# Altium schematic sheet motion.SchDoc
size A4
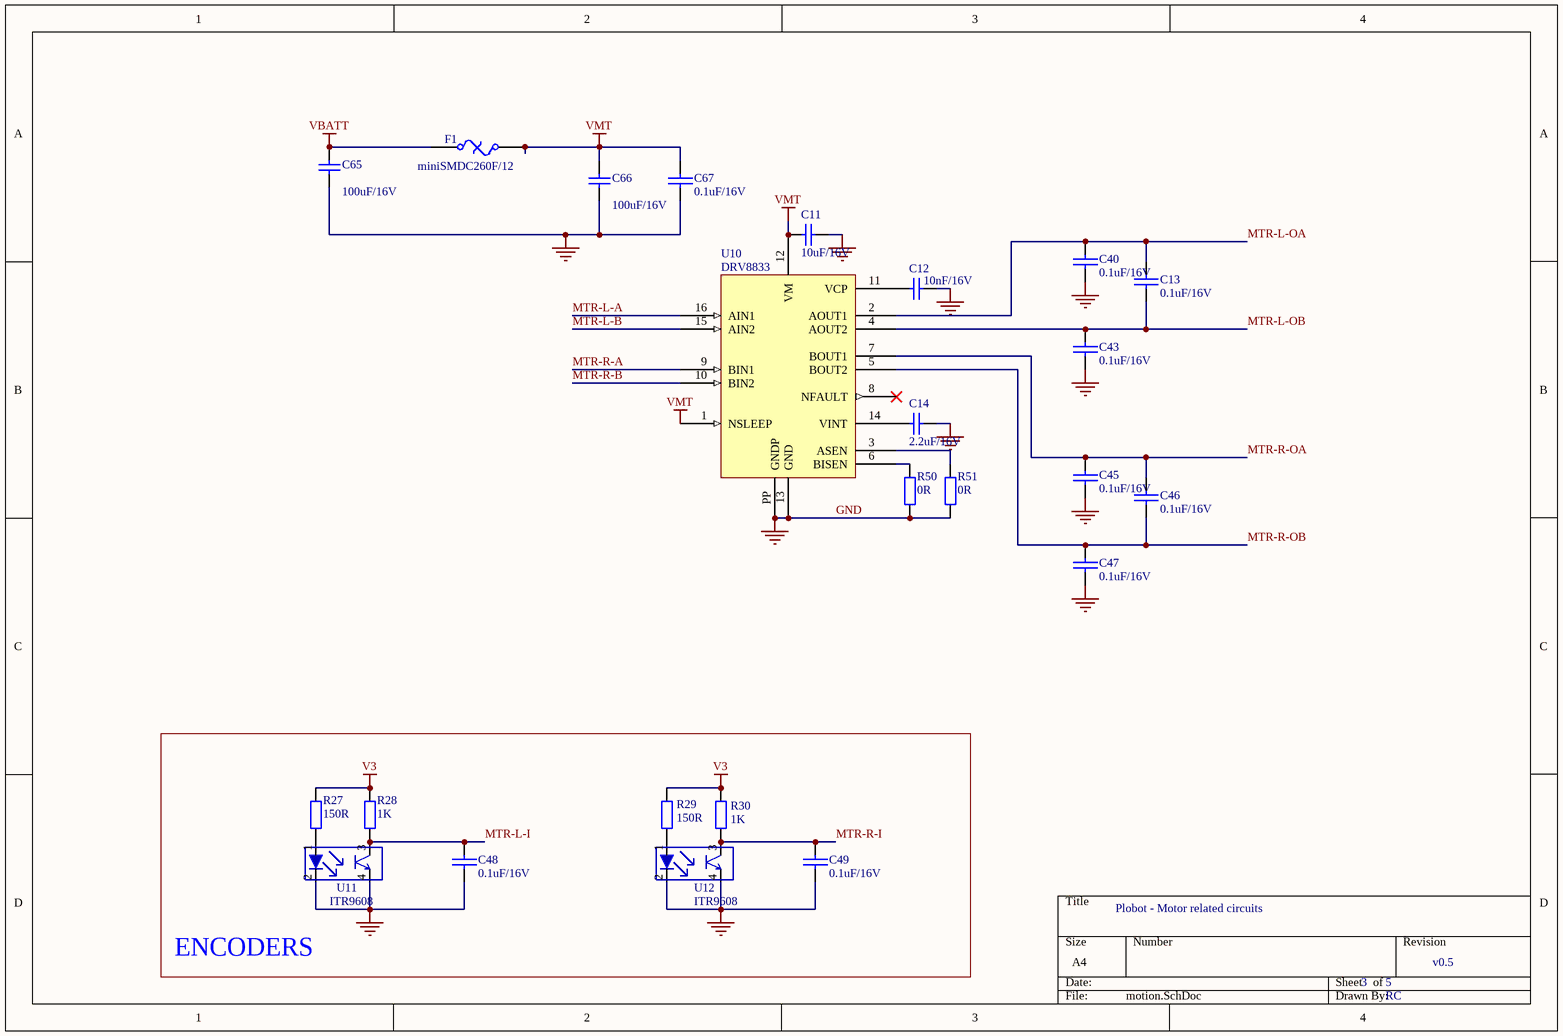
[diagram p0: motion.SchDoc]

## Parts
C11  10uF/16V  [CAPC1608N]
C12  10nF/16V  [CAPC1608N]
C13  0.1uF/16V  [CAPC1608N]
C14  2.2uF/16V  [CAPC1608N]
C40  0.1uF/16V  [CAPC1608N]
C43  0.1uF/16V  [CAPC1608N]
C45  0.1uF/16V  [CAPC1608N]
C46  0.1uF/16V  [CAPC1608N]
C47  0.1uF/16V  [CAPC1608N]
C48  0.1uF/16V  [CAPC1608N]
C49  0.1uF/16V  [CAPC1608N]
C65  100uF/16V  [Cap6.6X6.6]
C66  100uF/16V  [Cap6.6X6.6]
C67  0.1uF/16V  [CAPC1608N]
F1  miniSMDC260F/12  [miniSMDC260F/12]
R27  150R  [RESC1608N]
R28  1K  [RESC1608N]
R29  150R  [RESC1608N]
R30  1K  [RESC1608N]
R50  0R  [RESC1608N]
R51  0R  [RESC1608N]
U10  DRV8833  [DRV8833]
U11  ITR9608  [ITR9608]
U12  ITR9608  [ITR9608]

## Blocks framed on the sheet
ENCODERS: C48 C49 R27-R30 U11 U12

## Nets
GND: C11.1 C12.1 C14.1 C40.1 C43.1 C45.1 C47.1 C48.1 C49.1 C65.1 C66.1 C67.1 R50.1 R51.1 U10.13(GND) U10.PP(GNDP) U11.2(CATHODE) U11.4(ENITIER) U12.2(CATHODE) U12.4(ENITIER)
V3: R27.2 R28.2 R29.2 R30.2
VBATT: C65.2 F1.1
VMT: C11.2 C66.2 C67.2 F1.2 U10.1(NSLEEP) U10.12(VM)
MTR-L-A: U10.16(AIN1)
MTR-L-B: U10.15(AIN2)
MTR-L-I: C48.2 R28.1 U11.3(COLLECTOR)
MTR-L-OA: C13.2 C40.2 U10.2(AOUT1)
MTR-L-OB: C13.1 C43.2 U10.4(AOUT2)
MTR-R-A: U10.9(BIN1)
MTR-R-B: U10.10(BIN2)
MTR-R-I: C49.2 R30.1 U12.3(COLLECTOR)
MTR-R-OA: C45.2 C46.2 U10.7(BOUT1)
MTR-R-OB: C46.1 C47.2 U10.5(BOUT2)
NetC12_2: C12.2 U10.11(VCP)
NetC14_2: C14.2 U10.14(VINT)
NetR27_1: R27.1 U11.1(ANODE)
NetR29_1: R29.1 U12.1(ANODE)
NetR50_2: R50.2 U10.6(BISEN)
NetR51_2: R51.2 U10.3(ASEN)

Not connected (* = marked no-connect by the designer): U10 8(NFAULT)*

## Notes on the sheet
- Plobot - Motor related circuits
- 3
- 5
- v0.5
- RC

## Library data of the parts
C11 = Cap_2: Capacitor; Published: 8-Jun-2000; LatestRevisionDate: 17-Jul-2002; LatestRevisionNote: Re-released for DXP Platform.; PackageReference: RAD-0.3; Publisher: Altium Limited; PackageDescription: Radial Cap, Thru-Hole; 2 Leads; 0.3 in Pin Spacing; Value: 10uF/16V
C12-C14 C40 C43 C45-C49 C65-C67 = Cap: Capacitor
  C12: Published: 8-Jun-2000; LatestRevisionDate: 17-Jul-2002; LatestRevisionNote: Re-released for DXP Platform.; PackageReference: RAD-0.3; Publisher: Altium Limited; PackageDescription: Radial Cap, Thru-Hole; 2 Leads; 0.3 in Pin Spacing; Value: 10nF/16V
  C14: Published: 8-Jun-2000; LatestRevisionDate: 17-Jul-2002; LatestRevisionNote: Re-released for DXP Platform.; PackageReference: RAD-0.3; Publisher: Altium Limited; PackageDescription: Radial Cap, Thru-Hole; 2 Leads; 0.3 in Pin Spacing; Value: 2.2uF/16V
  C65 C66: Published: 8-Jun-2000; LatestRevisionDate: 17-Jul-2002; LatestRevisionNote: Re-released for DXP Platform.; PackageReference: RAD-0.3; Publisher: Altium Limited; PackageDescription: Radial Cap, Thru-Hole; 2 Leads; 0.3 in Pin Spacing; Value: 100uF/16V
F1 = Fuse Thermal: Thermal Fuse; Published: 24-Mar-1999; LatestRevisionDate: 17-Jul-2002; LatestRevisionNote: Re-released for DXP Platform.; PackageReference: PIN-W2/E2.8; Publisher: Altium Limited
R27-R30 R50 R51 = Res2: Resistor; Published: 8-Jun-2000; LatestRevisionDate: 17-Jul-2002; LatestRevisionNote: Re-released for DXP Platform.; PackageReference: AXIAL-0.4; Publisher: Altium Limited
  R27 R29: Value: 150R
  R28 R30: Value: 1K
  R50 R51: Value: 0R